# Altium schematic sheet Alim.SchDoc
size A4; Author: Fürst Nicolas; CompanyName: ETML-ES; Address1: Avenue Rencordon 1; Address2: 1004 Lausanne; Address3: Suisse; SheetNumber: 2; SheetTotal: 2
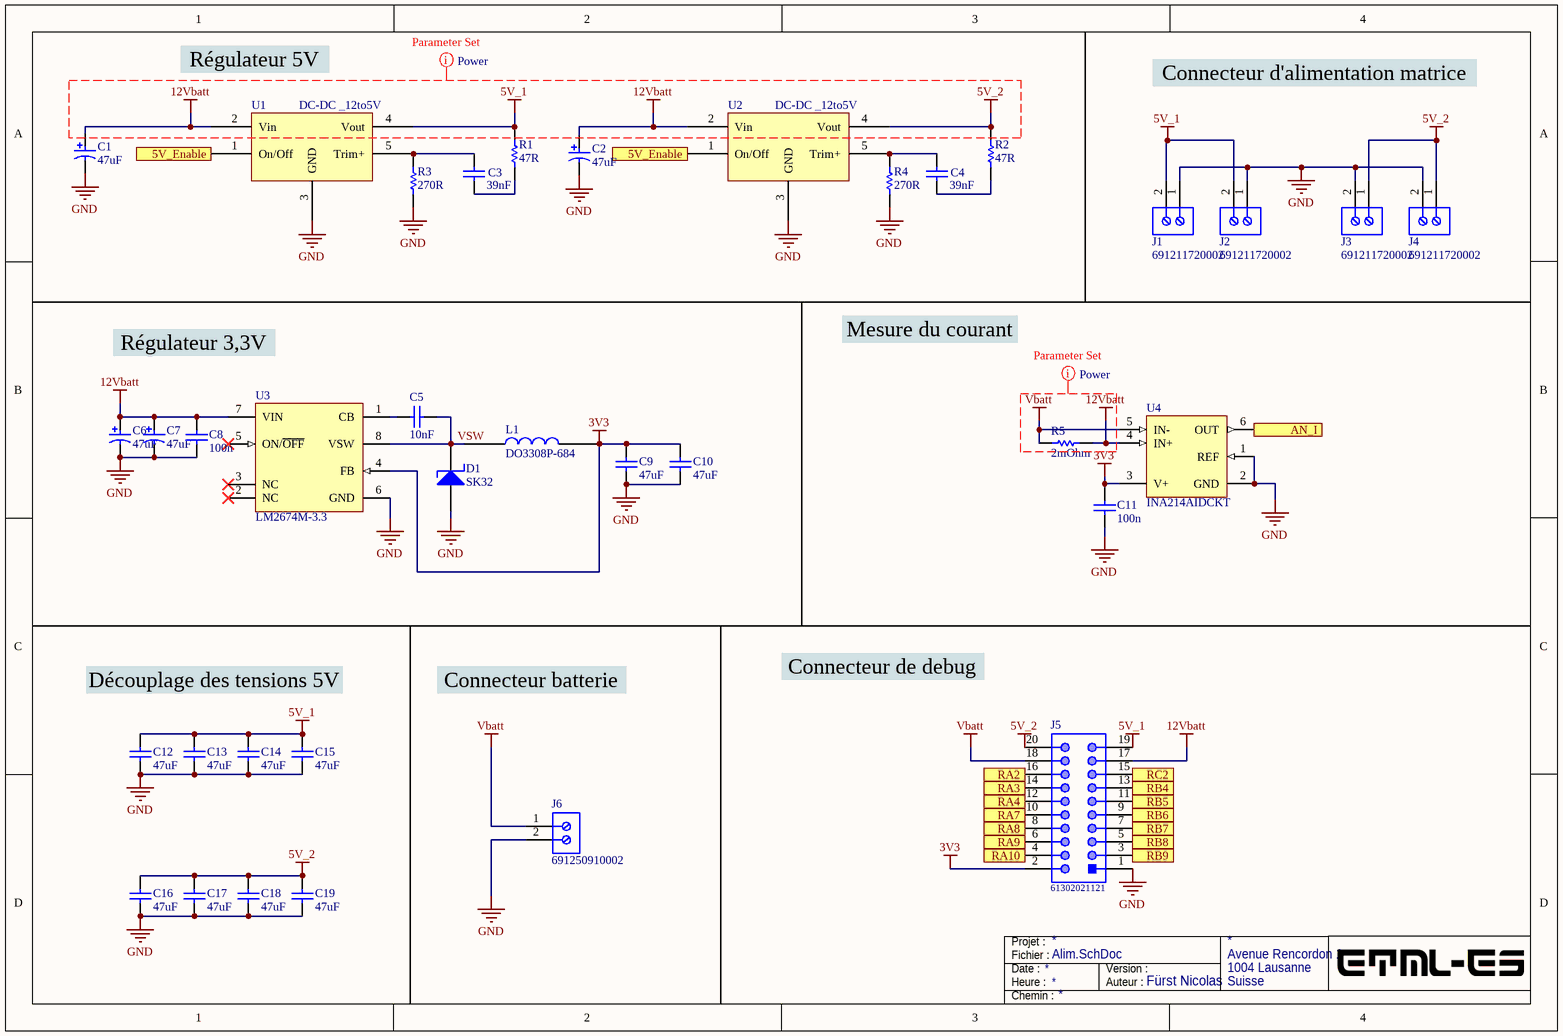
[diagram p0: Alim.SchDoc]

## Parts
C1  47uF  [Capacitor]
C2  47uF  [Capacitor]
C3  39nF  [CAPC0805(2012)155_L]
C4  39nF  [CAPC0805(2012)155_L]
C5  10nF  [CAPC0805(2012)155_L]
C6  47uF  [Capacitor]
C7  47uF  [Capacitor]
C8  100n  [CAPC0805(2012)155_L]
C9  47uF  [CAPC1206(3216)190_N]
C10  47uF  [CAPC1206(3216)190_N]
C11  100n  [CAPC0805(2012)155_L]
C12  47uF  [CAPC1206(3216)190_N]
C13  47uF  [CAPC1206(3216)190_N]
C14  47uF  [CAPC1206(3216)190_N]
C15  47uF  [CAPC1206(3216)190_N]
C16  47uF  [CAPC1206(3216)190_N]
C17  47uF  [CAPC1206(3216)190_N]
C18  47uF  [CAPC1206(3216)190_N]
C19  47uF  [CAPC1206(3216)190_N]
D1  SK32  [DO-214AC]
J1  691211720002  [691211720002]
J2  691211720002  [691211720002]
J3  691211720002  [691211720002]
J4  691211720002  [691211720002]
J5  61302021121  [61302021121]
J6  691250910002  [691250910002]
L1  DO3308P-684  [DO3308P]
R1  47R  [RESC0805(2012)_N]
R2  47R  [RESC0805(2012)_N]
R3  270R  [RESC0805(2012)_N]
R4  270R  [RESC0805(2012)_N]
R5  2mOhm  [RESC1206(3216)_N]
U1  DC-DC _12to5V  [DC-DC]
U2  DC-DC _12to5V  [DC-DC]
U3  LM2674M-3.3  [M08A_N]
U4  INA214AIDCKT  [DCK0006A_N]

## Ports
5V_Enable, AN_I, RA2, RA3, RA4, RA7, RA8, RA9, RA10, RB4, RB5, RB6, RB7, RB8, RB9, RC2

## Nets
3V3: C9.2 C10.2 C11.1 J5.2 L1.2 U3.4(FB) U4.3(V+)
5V_1: C12.2 C13.2 C14.2 C15.2 J1.2 J2.2 J5.19 R1.2 U1.4(Vout)
5V_2: C16.2 C17.2 C18.2 C19.2 J3.1 J4.1 J5.20 R2.2 U2.4(Vout)
12Vbatt: C1.1 C2.1 C6.1 C7.1 C8.1 J5.17 R5.1 U1.2(Vin) U2.2(Vin) U3.7(VIN) U4.4(IN+)
GND: C1.2 C2.2 C6.2 C7.2 C8.2 C9.1 C10.1 C11.2 C12.1 C13.1 C14.1 C15.1 C16.1 C17.1 C18.1 C19.1 D1.2(A) J1.1 J2.1 J3.2 J4.2 J5.1 J6.2 R3.1 R4.1 U1.3(GND) U2.3(GND) U3.6(GND) U4.1(REF) U4.2(GND)
Vbatt: J5.18 J6.1 R5.2 U4.5(IN-)
5V_Enable: U1.1(On/Off) U2.1(On/Off) ; port 5V_Enable
AN_I: U4.6(OUT) ; port AN_I
RA2: J5.16 ; port RA2
RA3: J5.14 ; port RA3
RA4: J5.12 ; port RA4
RA7: J5.10 ; port RA7
RA8: J5.8 ; port RA8
RA9: J5.6 ; port RA9
RA10: J5.4 ; port RA10
RB4: J5.13 ; port RB4
RB5: J5.11 ; port RB5
RB6: J5.9 ; port RB6
RB7: J5.7 ; port RB7
RB8: J5.5 ; port RB8
RB9: J5.3 ; port RB9
RC2: J5.15 ; port RC2
VSW: C5.2 D1.1(K) L1.1 U3.8(VSW)
NetC3_1: C3.1 R3.2 U1.5(Trim+)
NetC3_2: C3.2 R1.1
NetC4_1: C4.1 R2.1
NetC4_2: C4.2 R4.2 U2.5(Trim+)
NetC5_1: C5.1 U3.1(CB)

Not connected (* = marked no-connect by the designer): U3 2(NC)* 3(NC)* 5(ON/~{OFF})*

## Layout directives
net class Power: 5V_1, 5V_2, 12Vbatt, Vbatt

## Notes on the sheet
- Régulateur 5V
- Connecteur d'alimentation matrice
- Régulateur 3,3V
- Mesure du courant
- Découplage des tensions 5V
- Connecteur batterie
- Connecteur de debug
- Fichier :
- Date :
- Heure :
- Projet :
- Auteur :
- Version :
- Chemin :

## Library data of the parts
C1 C2 C6 C7 = CMP-2000-06221-1: Conductive Polymer Hybrid Aluminum Electrolytic Capacitor, 100 uF, +/- 20%, 50 V, -55 to 105 degC, 2-Pin SMD (G), RoHS, Tape and Reel; Case Height: 10.5mm; Voltage Rating DC: 50V; Case Diameter: 10mm; Ripple Current: 2A; Load Life: 10000Hour; Brand: Panasonic; Case Length: 10.2mm; ESR: 28mOhms; Capacitance: 100uF; Manufacturer URL: http://www.panasonic.com/; Minimum Operating Temperature: -55C; Datasheet Version: 06/2016; Product Category: AluminumOrganicPolymerCapacitors; Maximum Operating Temperature: +105C; Package Description: 2-Pin Surface Mount Device, Body 10.3 x 10.3 mm; Package Reference: ZA-G; RoHS: Details; Series: ZA; Tolerance: 20%; Product: AluminumElectrolyticCapacitors; Factory Pack Quantity: 500; Manufacturer: Panasonic; Termination Style: SMD/SMT; Datasheet URL: https://industrial.panasonic.com/cdbs/www-data/pdf/RDD0000/DMD0000COL56.pdf; Mounting Technology: SurfaceMount; Packaging: Reel; Height: 10.5mm
C3-C5 C8 C11 = Capa: Case-EIA: 0805; Rated Voltage: 10 V; Value: 4.7uF; Tolerance: Â±10%; Case-Metric: 2012; Max Thickness: 1.55 mm; Technology: SMT
C9 C10 C12-C19 = CMP-1037-05002-1: CAP 47uF 10V ±20% 1206 (3216 Metric) Thickness 1.9mm SMD; Case-Metric: 3216; Case-EIA: 1206; Tolerance: Â±20%; Technology: SMT; Rated Voltage: 10 V; Value: 47uF; Max Thickness: 1.9 mm
D1 = SK32: Shotky diod; PartNumber: 151031SS04000; Manufacturer: Wuerth Elektronik; Emitting color: Super Red; ComponentLink2Description: Datasheet; ComponentLink1URL: http://www.we-online.com; ComponentLink1Description: Manufacturer URL; PackageReference: Type 3mm; ComponentLink2URL: http://katalog.we-online.de/pbs/datasheet/7448042001.pdfhttp://katalog.we-online.de/pbs/datasheet/7448042001.pdfhttp://katalog.we-online.de/pbs/datasheet/7448042001.pdfhttp://katalog.we-online.de/pbs/datasheet/151031SS04000.pdf
J1-J4 = CMP-1502-02524-1: Serie 211 - 5.00 mm 45deg Entry Modular with Rising Cage Clamp - 15.50 mm Height WR-TBL, 2 pin; Manufacturer: Wurth Elektronik; Pitch: 5.00mm; Pin Number: 2; Manufacturer URL: http://www.we-online.de; Mounting Technology: THT; Packaging: Box; Datasheet URL: http://katalog.we-online.de/em/datasheet/6912117200xx.pdf; Operating Temperature: -40to105degC; Package Reference: 691211720002; Part Number: 691211720002; Publisher: WurthElektronik
J5 = CMP-1502-01104-1: THT Vertical Pin Header WR-PHD, Pitch 2.54 mm, Dual Row, 20 pins; Manufacturer: Wurth Elektronik; Pin Number: 20; Withstanding Voltage: 500VAC; Contact Resistance: 20mOhm; Gender: Male; Working Voltage: 250VAC; Pitch: 2.54mm; Rated Current: 3A; Datasheet URL: https://katalog.we-online.de/em/datasheet/6130xx21121.pdf; Mounting Technology: THT; Package Reference: 61302021121; Manufacturer URL: http://www.we-online.de; Part Number: 61302021121; Orientation: Vertical; Operating Temperature: -40to105degC; Row Number: Dual; Publisher: WurthElektronik; Packaging: Bag
J6 = CMP-1502-02750-1: Serie 2509 - 9.52 mm Horizontal Entry Modular with Rising Cage Clamp WR-TBL, 2 pin; Manufacturer: Wurth Elektronik; Pin Number: 2; Pitch: 9.52mm; Datasheet URL: http://katalog.we-online.de/em/datasheet/6912509100XX.pdf; Mounting Technology: THT; Package Reference: 691250910002; Publisher: WurthElektronik; Packaging: Box; Manufacturer URL: http://www.we-online.de; Operating Temperature: -30to120degC; Part Number: 691250910002
R1-R5 = Resistor: Value: 1000000.00 Ohm; Case-Metric: 2012; Case-EIA: 0805; Power: 0.125 W; Tolerance: 1 %; Technology: SMT
U3 = CMP-0069-00679-2: SIMPLE SWITCHER® Power Converter High Efficiency 500mA Step-Down Voltage Regulator, 8-pin Narrow SOIC; Manufacturer: National Semiconductor; PackageTopMarking: NSZXTT*2674*M3.3; PowerWise: N; ComponentLink1Description: LM2674 Datasheet; DatasheetVersion: Mar-2005; CompType: Switcher; ComponentLink2URL: http://www.national.com/pf/LM/LM2674.html; ComponentLink1URL: http://www.national.com/ds/LM/LM2674.pdf; RevisionNote: Component URLs added; ComponentLink2Description: LM2674 Web Page; ComponentLink3URL: http://www.national.com/packaging/folders/m08a.html; PackageVersion: revM, May-2009; PackageDescription: SOIC Narrow, 4.9 x 3.9 x 1.45mm, 8 Lead, 1.27mm Pitch; PinCount: 8; PackageReference: M08A; ComponentLink3Description: M08A Package Page; Code_IPC: SOIC127P600-8; Code_JEDEC: MS-012-AA; RoHS: N
U4 = CMP-2000-06456-1: Voltage Output, High / Low-Side Measurement, Bi-Directional Zero-Drift Series, Current Shunt Monitor, 2.7 to 26 V, -40 to 125 degC, 6-Pin SOT-23 (DCK6), Green (RoHS & no Sb/Br), Tape and Reel; Package Version: 4093553-4/G, 01/2007; Development Kit: INA210-214EVM; Unit Weight: 0.000088oz; Vcm - Common Mode Voltage: -0.3Vto+26V; Gain V/V: 100V/V; Operating Supply Current: 115uA; Topology: CurrentShuntFeedback; Number of Channels: 1Channel; Accuracy: 1%; Amplifier Type: CurrentSense; Gain Error: 0.02%; Vos - Input Offset Voltage: 60uV; Brand: TexasInstruments; Supply Voltage - Max: 26V; CMRR - Common Mode Rejection Ratio: 105dB; Supply Voltage - Min: 2.7V; GBP - Gain Bandwidth Product: 30kHz; Product Category: CurrentSenseAmplifiers; Series: INA214; Mounting Style: SMD/SMT; Datasheet URL: http://www.ti.com/lit/gpn/INA214?keyMatch=INA214AIDCKT&tisearch=Search-EN-Everything; Maximum Operating Temperature: +125C; Package / Case: SOT-23-6; Minimum Operating Temperature: -40C; Datasheet Version: Rev. G, 07/2014; RoHS: True; Manufacturer URL: http://www.ti.com/; Package Description: 6-Pin Plastic Small Outline, Body 2 x 1.25 mm, Pitch 0.65 mm; Product: CurrentSenseAmplifiers; Package Reference: DCK6; Packaging: Reel; Manufacturer: TexasInstruments; Mounting Technology: SurfaceMount